# EAGLE schematic ParticleCounter (EAGLE 9.4.2)
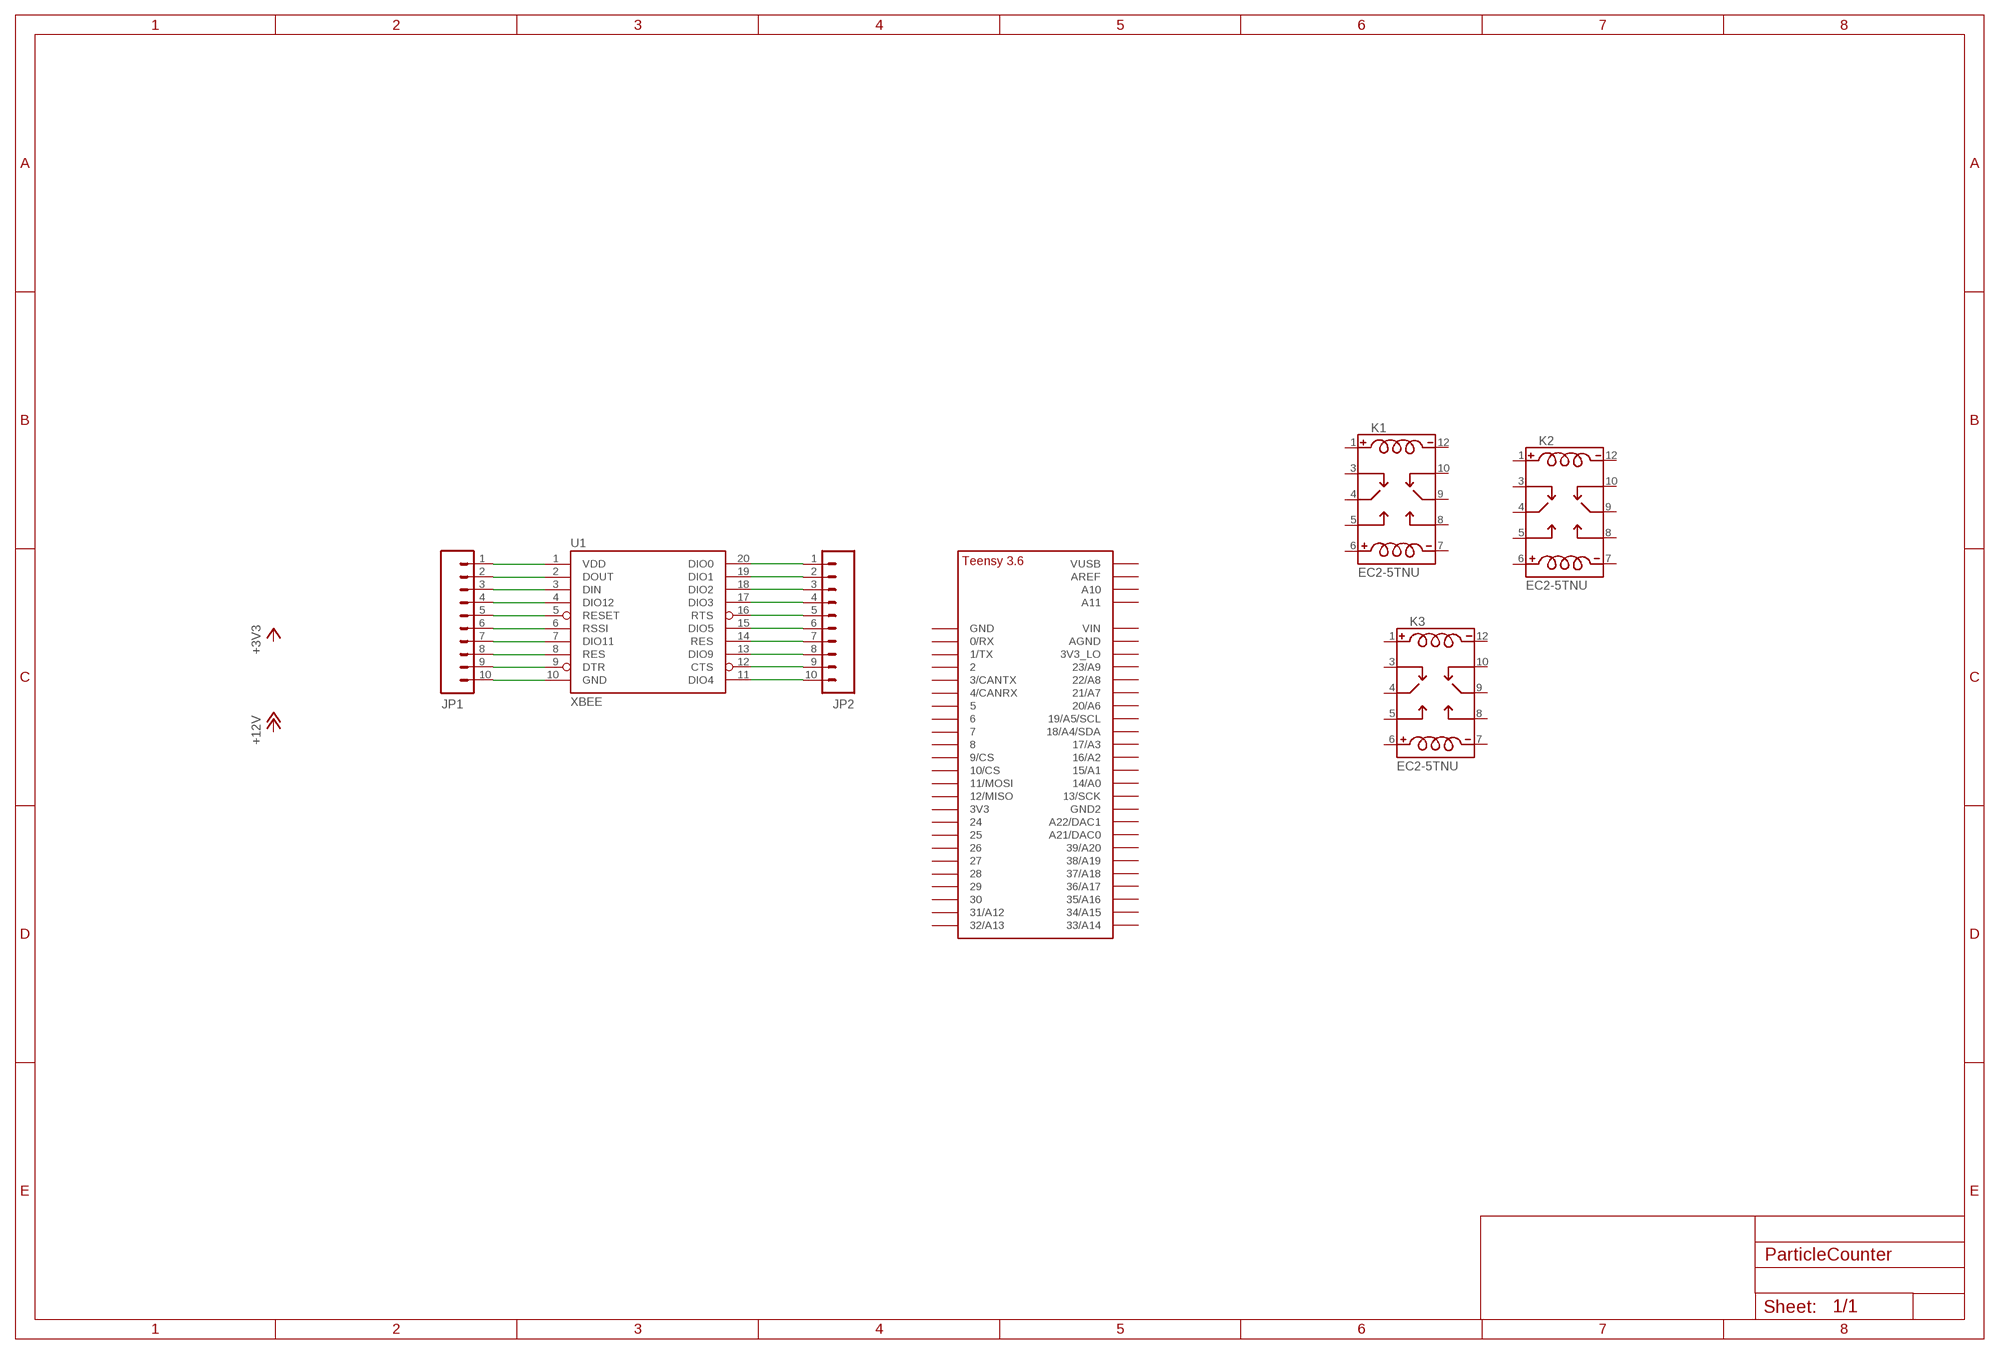
[diagram p0: schematic, sheet 1]

## Parts
JP1  M100.1  [1X10]
JP2  M100.1  [1X10]
K1  EC2-5TNU  [RELAY_EC2-5TNU]
K2  EC2-5TNU  [RELAY_EC2-5TNU]
K3  EC2-5TNU  [RELAY_EC2-5TNU]
U1  XBEE  XBEE-1B1  [XBEE-1]
U$1  TEENSY_3.5/3.6_BASIC  [TEENSY_3.5/3.6_BASIC]

## Nets
N$1: JP1.5 U1.5(RESET)
N$21: JP1.1 U1.1(VDD)
N$22: JP1.2 U1.2(DOUT)
N$23: JP1.3 U1.3(DIN)
N$24: JP1.4 U1.4(DIO12)
N$26: JP1.6 U1.6(RSSI)
N$27: JP1.7 U1.7(DIO11)
N$28: JP1.8 U1.8(RES)
N$29: JP1.9 U1.9(DTR)
N$30: JP1.10 U1.10(GND)
N$31: JP2.10 U1.11(DIO4)
N$32: JP2.9 U1.12(CTS)
N$33: JP2.8 U1.13(DIO9)
N$34: JP2.7 U1.14(RES)
N$35: JP2.6 U1.15(DIO5)
N$36: JP2.5 U1.16(RTS)
N$37: JP2.4 U1.17(DIO3)
N$38: JP2.3 U1.18(DIO2)
N$39: JP2.2 U1.19(DIO1)
N$40: JP2.1 U1.20(DIO0)
Unconnected: K1.1(C1) K1.3(NC1) K1.4(M1) K1.5(NO1) K1.6(C3) K1.7(C4) K1.8(NO) K1.9(M) K1.10(NC) K1.12(C2) K2.1(C1) K2.3(NC1) K2.4(M1) K2.5(NO1) K2.6(C3) K2.7(C4) K2.8(NO) K2.9(M) K2.10(NC) K2.12(C2) K3.1(C1) K3.3(NC1) K3.4(M1) K3.5(NO1) K3.6(C3) K3.7(C4) K3.8(NO) K3.9(M) K3.10(NC) K3.12(C2) U$1.0/RX U$1.1/TX U$1.2 U$1.3/CANTX U$1.3V3 U$1.3V3_LO U$1.4/CANRX U$1.5 U$1.6 U$1.7 U$1.8 U$1.9/CS U$1.10/CS U$1.11/MOSI U$1.12/MISO U$1.13/SCK U$1.14/A0 U$1.15/A1 U$1.16/A2 U$1.17/A3 U$1.18/A4/SDA U$1.19/A5/SCL U$1.20/A6 U$1.21/A7 U$1.21/DAC0(A21/DAC0) U$1.22/A8 U$1.23/A9 U$1.24 U$1.25 U$1.26 U$1.27 U$1.28 U$1.29 U$1.30 U$1.31/A12 U$1.32/A13 U$1.33/A14 U$1.34/A15 U$1.35/A16 U$1.36/A17 U$1.37/A18 U$1.38/A19 U$1.39/A20 U$1.A10 U$1.A11 U$1.A22/DAC1 U$1.AGND U$1.AREF U$1.GND U$1.GND2 U$1.VIN U$1.VUSB

## Library data of the parts
JP1 JP2 = SparkFun:M10: Header 10 Standard 10-pin 0.1" header. Use with straight break away headers (SKU : PRT-00116), right angle break away headers (PRT-00553), swiss pins (PRT-00743), machine pins (PRT-00117), and female headers (PRT-00115).
K1-K3 = EC2-5TNU:EC2-5TNU: Relay; E-Mech; Latching; DPDT; Ctrl-V 5DC; 2A; 250VAC; PCB Mnt; Thru Hole; EC2/EE2 Series; AVAILABILITY: Unavailable; DESCRIPTION: Relay; E-Mech; Latching; DPDT; Ctrl-V 5DC; 2A; 250VAC; PCB Mnt; Thru Hole; EC2/EE2 Series; MF: KEMET; MP: EC2-5TNU; PACKAGE: None; PRICE: None
U1 = SparkFun:XBEE-1
U$1 = Teensy356:TEENSY_3.5/3.6_BASIC

## Net classes
0 default: width 0.254 mm